# EasyEDA Pro project ProPrj_SCH_MOUSE_2024-12-04_2025-01-11.epro

# Schematic MOUSE
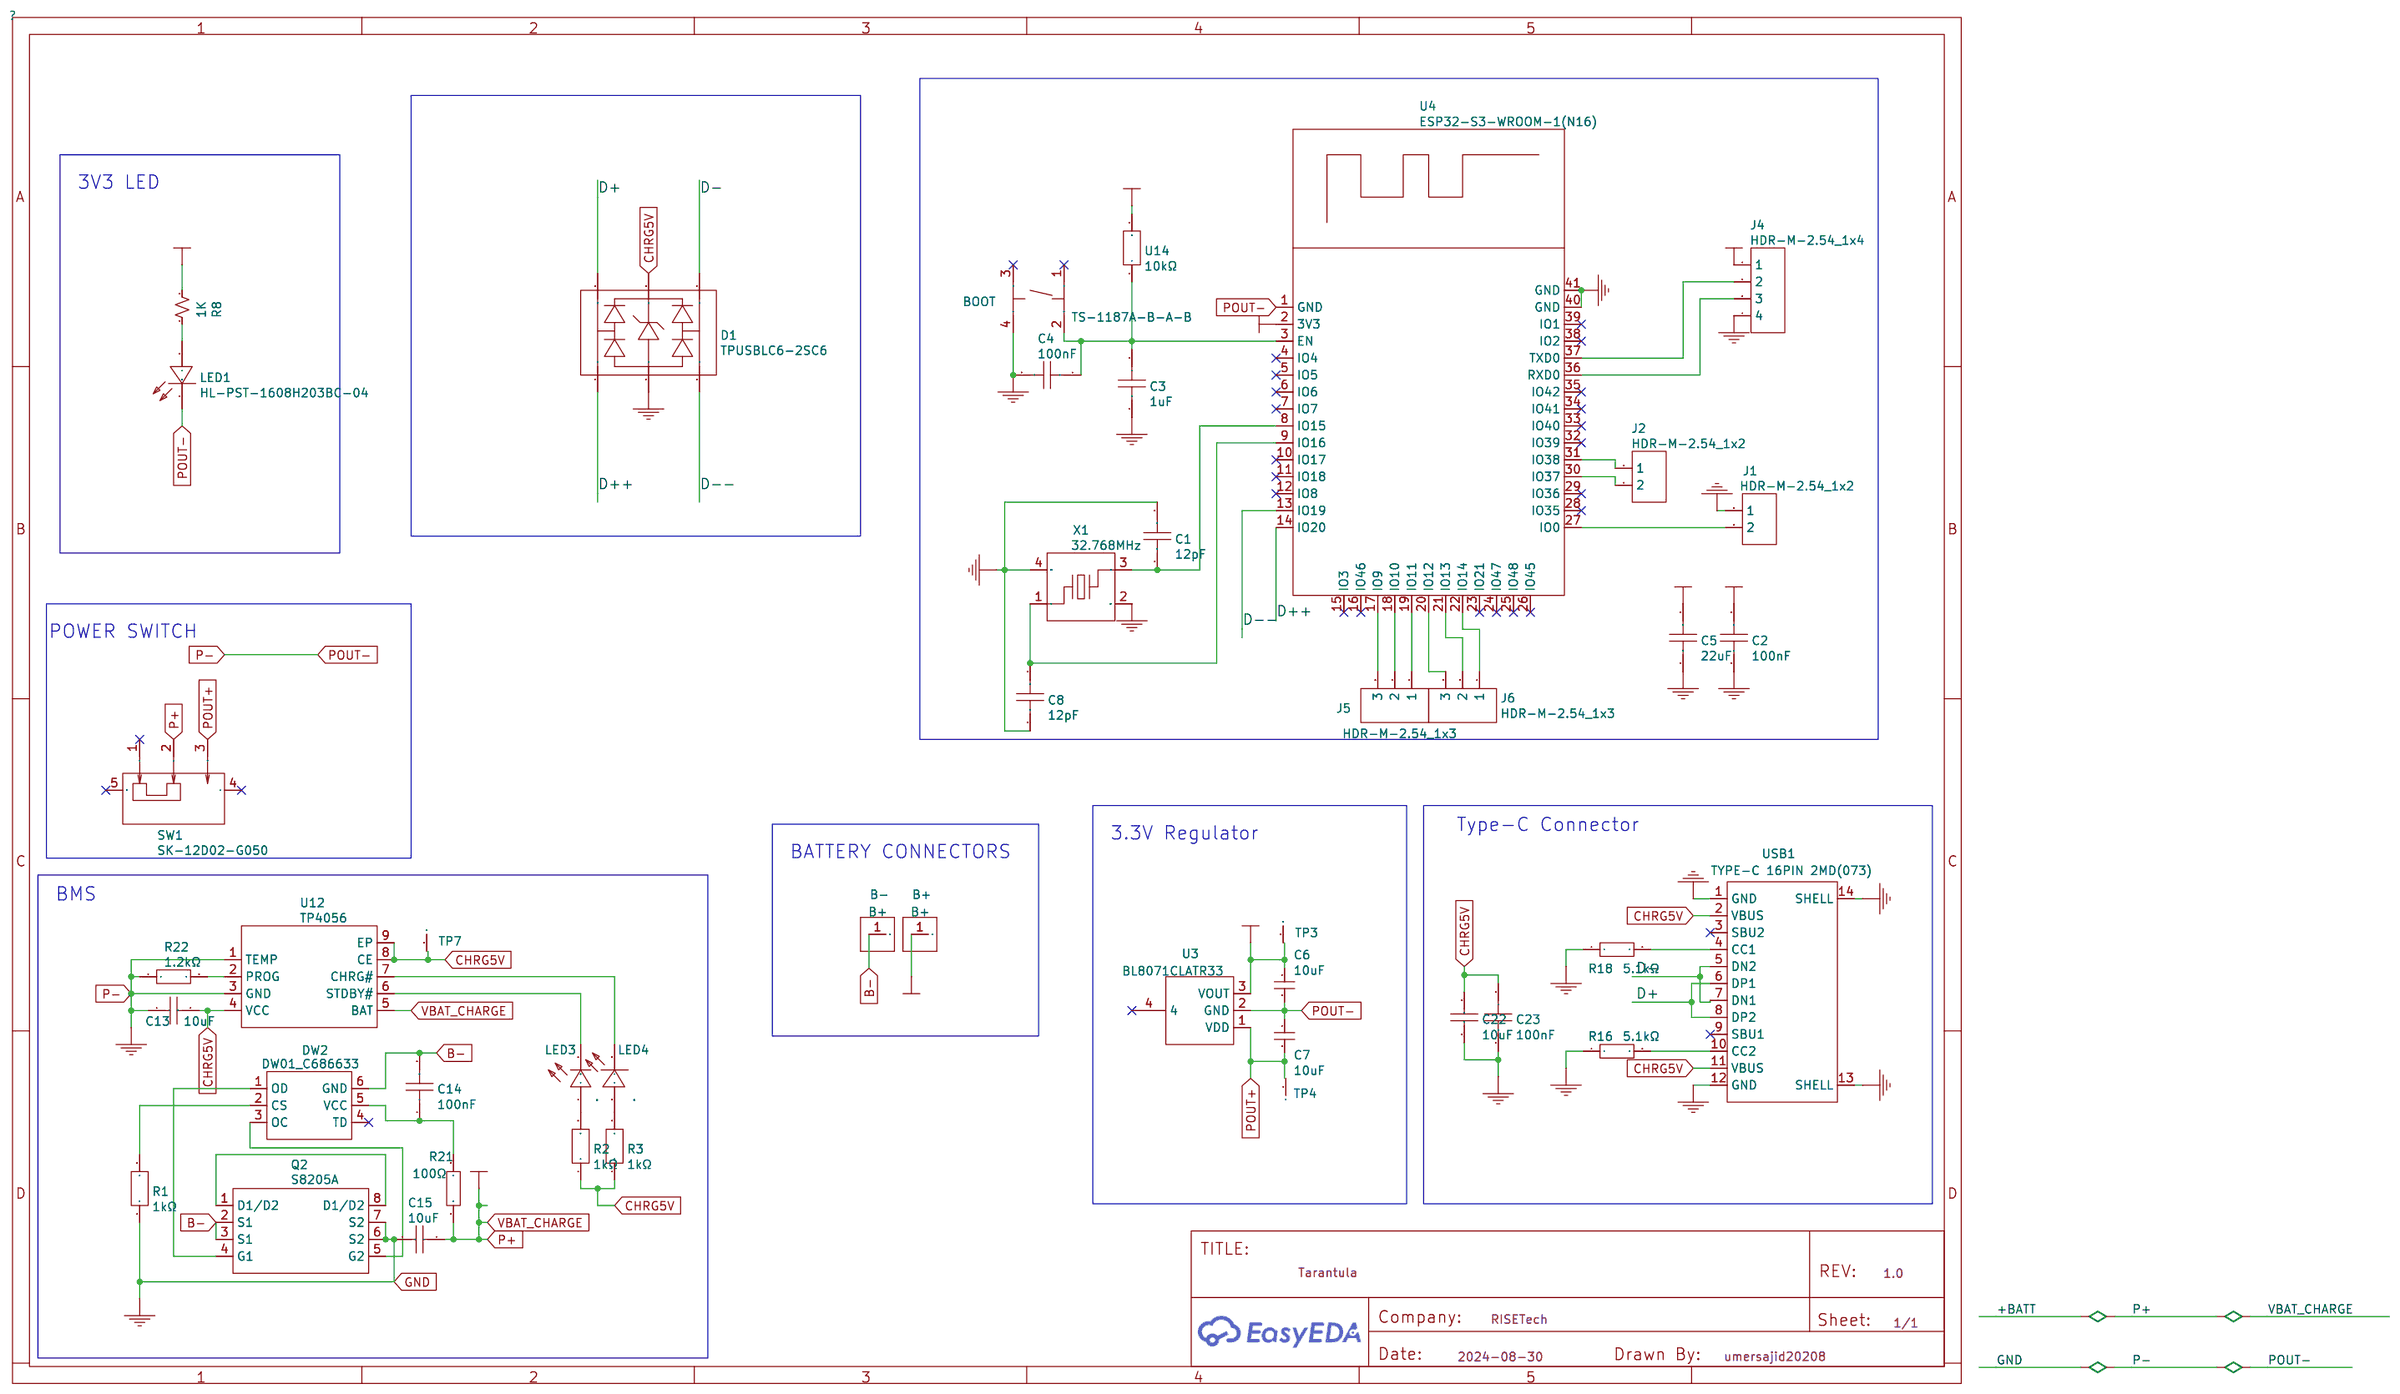
[diagram p0: schematic sheet]

## Parts
B+  B+  [TESTPOINT-SMD_L2.1-L1.1]
B-  B+  [TESTPOINT-SMD_L2.1-L1.1]
BOOT  TS-1187A-B-A-B  [SW-SMD_4P-L5.1-W5.1-P3.70-LS6.5-TL-2]
C1  12pF  [C0603]
C2  100nF  [C0402]
C3  1uF  [C0603]
C4  100nF  [C0402]
C5  22uF  [C0603]
C6  10uF  [C0603]
C7  10uF  [C0603]
C8  12pF  [C0603]
C13  10uF  [C0402]
C14  100nF  [C0402]
C15  10uF  [C0402]
C22  10uF  [C0402]
C23  100nF  [C0402]
D1  TPUSBLC6-2SC6  [SOT-23-6_L2.9-W1.6-P0.95-LS2.8-BR]
DW2  DW01_C686633  [SOT-23-6_L2.9-W1.6-P0.95-LS2.8-BR]
J1  HDR-M-2.54_1x2  [HDR-M-2.54_1X2]
J2  HDR-M-2.54_1x2  [HDR-M-2.54_1X2]
J4  HDR-M-2.54_1x4  [HDR-M-2.54_1X4]
J5  HDR-M-2.54_1x3  [HDR-M-2.54_1X3]
J6  HDR-M-2.54_1x3  [HDR-M-2.54_1X3]
LED1  HL-PST-1608H203BC-04  [LED0603-RD_BLUE]
LED3  .  [LED0603-R-RD]
LED4  .  [LED0603-R-RD]
Q2  S8205A  [TSSOP-8_L4.4-W3.0-P0.65-LS6.4-BL]
R1  1kΩ  [R0603]
R2  1kΩ  [R0603]
R3  1kΩ  [R0603]
R8  1K  [R0603]
R16  5.1kΩ  [R0402]
R18  5.1kΩ  [R0402]
R21  100Ω  [R0402]
R22  1.2kΩ  [R0402]
SW1  SK-12D02-G050  [SW-TH_SK-12D02-G050]
TP3  TEST_POINT_TH  [MEASUREMENT_POINT_TH]
TP4  TEST_POINT_TH  [MEASUREMENT_POINT_TH]
TP7  TEST_POINT_TH  [MEASUREMENT_POINT_TH]
U3  BL8071CLATR33  [SOT-223-3_L6.5-W3.4-P2.30-LS7.0-BR]
U4  ESP32-S3-WROOM-1(N16)  [WIRELM-SMD_ESP32-S3-WROOM-1]
U12  TP4056  [ESOP-8_L4.9-W3.9-P1.27-LS6.0-BL-EP]
U14  10kΩ  [R0402]
USB1  TYPE-C 16PIN 2MD(073)  [USB-C-SMD_TYPE-C-6PIN-2MD-073]
X1  32.768MHz  [CRYSTAL-SMD_4P-L3.2-W2.5-BL]

## Library data of the parts
B+ B- = B+
BOOT = TS-1187A-B-A-B: Supplier: LCSC; Supplier Part: C318884; Manufacturer: XKB Connectivity(中国星坤); JLCPCB Part Class: Basic Part
C1 C8 = 12pF: Supplier: LCSC; Supplier Part: C482468; Manufacturer: Chinocera(华瓷); Manufacturer Part: HGC0603G0120J500NTHJ; JLCPCB Part Class: Extended Part
C2 C4 = 100nF: Supplier: LCSC; Supplier Part: C432917; Manufacturer: TDK; Manufacturer Part: C1005X7R1H104KT000S; JLCPCB Part Class: Extended Part
C3 = 1uF: Supplier: LCSC; Supplier Part: C2918486; Manufacturer: SAMWHA(三和); Manufacturer Part: CS1608X5R105K250NRB; JLCPCB Part Class: Extended Part
C5 = 22uF: Supplier: LCSC; Supplier Part: C7432770; Manufacturer: Chinocera(华瓷); Manufacturer Part: HGC0603R5226M100NTHJ; JLCPCB Part Class: Extended Part
C6 C7 = 10uF: Manufacturer_Name: Samsung Electro-Mechanics; Manufacturer_Part_Number: CL21A106KOQNNNE; Manufacturer: Samsung Electro-Mechanics; Supplier Part: C19702
C13 C15 C22 = 10uF: Supplier: LCSC; Manufacturer Part: CL05A106MQ5NUNC; Manufacturer: SAMSUNG; Supplier Part: C15525; JLCPCB Part Class: Basic Part; Resistance: 5.1K
C14 C23 = 100nF: Supplier: LCSC; Supplier Part: C307331; Manufacturer: Samsung Electro-Mechanics; Manufacturer Part: CL05B104KB54PNC; JLCPCB Part Class: Basic Part
D1 = TPUSBLC6-2SC6: Supplier: LCSC; Supplier Part: C558442; Manufacturer: TECH PUBLIC(台舟); JLCPCB Part Class: Extended Part
DW2 = DW01_C686633: Supplier: LCSC; Supplier Part: C686633; Manufacturer: PJ(Pingjingsemi); Manufacturer Part: DW01; JLCPCB Part Class: Extended Part
J1 J2 = HDR-M-2.54_1x2: Supplier Part: C124375; Supplier: LCSC
J4 = HDR-M-2.54_1x4: Supplier Part: C124378; Supplier: LCSC
J5 J6 = HDR-M-2.54_1x3: Supplier Part: C180248; Supplier: LCSC
LED1 = HL-PST-1608H203BC-04: Supplier: LCSC; Supplier Part: C497939; Manufacturer: HONGLITRONIC(鸿利光电); JLCPCB Part Class: Extended Part
LED3 = .: Supplier: LCSC; Manufacturer: EVERLIGHT; Manufacturer Part: 19-217/GHC-YR1S2/3T; Supplier Part: C72043; JLCPCB Part Class: Basic Part
LED4 = .: Supplier: LCSC; Manufacturer: KENTO; Manufacturer Part: KT-0603R; Supplier Part: C2286; JLCPCB Part Class: Basic Part
Q2 = S8205A: Supplier: LCSC; Supplier Part: C436910; Manufacturer: TF(拓锋); JLCPCB Part Class: Extended Part
R1-R3 = 1kΩ: Supplier: LCSC; Supplier Part: C2924142; Manufacturer: Viking(光颉); Manufacturer Part: AR03FTDX1001A; JLCPCB Part Class: Extended Part
R8 = 1K: Manufacturer_Part_Number: AC0603JR-071KL; Supplier Part: C21190
R16 R18 = 5.1kΩ: Supplier: LCSC; Manufacturer: UniOhm; Manufacturer Part: 0402WGF5101TCE; Supplier Part: C25905; Resistance: 5.1K; JLCPCB Part Class: Basic Part
R21 = 100Ω: Supplier: LCSC; Manufacturer: UniOhm; Manufacturer Part: 0402WGF1000TCE; Supplier Part: C25076; Resistance: 100; JLCPCB Part Class: Basic Part
R22 = 1.2kΩ: Supplier: LCSC; Manufacturer: UniOhm; Manufacturer Part: 0402WGF1201TCE; Supplier Part: C25862; Resistance: 1.2K; JLCPCB Part Class: Basic Part
SW1 = SK-12D02-G050: Supplier: LCSC; Supplier Part: C2930975; Manufacturer: G-Switch(品赞); JLCPCB Part Class: Extended Part
TP3 TP4 TP7 = TEST_POINT_TH: Pin: 1
U3 = BL8071CLATR33: Supplier: LCSC; Supplier Part: C401677; Manufacturer: Shanghai Belling; JLCPCB Part Class: Extended Part
U4 = ESP32-S3-WROOM-1(N16): Supplier: LCSC; Supplier Part: C2913199; Manufacturer: ESPRESSIF(乐鑫); Manufacturer Part: ESP32-S3-WROOM-1-N16; JLCPCB Part Class: Extended Part
U12 = TP4056: Supplier: LCSC; Supplier Part: C16581; Manufacturer: TOPPOWER; JLCPCB Part Class: Basic Part
U14 = 10kΩ: Supplier: LCSC; Supplier Part: C5119777; Manufacturer: RALEC(旺诠); Manufacturer Part: RAT021002FTH; JLCPCB Part Class: Extended Part
USB1 = TYPE-C 16PIN 2MD(073): Supplier: LCSC; Supplier Part: C2765186; Manufacturer: SHOU HAN(首韩); JLCPCB Part Class: Extended Part
X1 = 32.768MHz: Supplier: LCSC; Supplier Part: C20885045; Manufacturer: YJX(雅晶鑫); Manufacturer Part: T322532768MLBDE2X; JLCPCB Part Class: Extended Part

## Nets
+3V3: C2.2 C5.2 C6.1 J4.1 R8.1 U3.3(VOUT) U4.2(3V3) U14.2
GND: BOOT.4(D) C1.2 C2.1 C3.1 C4.2 C5.1 C6.2 C7.1 C8.1 C13.1 C15.2 C22.1 C23.1 D1.2(GND) J1.1 J4.4 LED1.1(C) Q2.6(S2) Q2.7(S2) R1.1 R16.1 R18.1 R22.1 U3.2(GND) U4.1(GND) U4.40(GND) U4.41(GND) U12.1(TEMP) U12.3(GND) USB1.1(GND) USB1.12(GND) USB1.13(SHELL) USB1.14(SHELL) X1.2(GND) X1.4(GND)
+BATT: B+.1 C15.1 R21.1 SW1.2 U12.5(BAT)
B-: B-.1 C14.2 DW2.6(GND) Q2.2(S1) Q2.3(S1)
CHRG5V: C13.2 C22.2 C23.2 D1.5(VBUS) R2.1 R3.1 U12.4(VCC) U12.8(CE) U12.9(EP) USB1.2(VBUS) USB1.11(VBUS)
D+: D1.6(I/O1) USB1.6(DP1) USB1.8(DP2)
D++: D1.1(I/O1) U4.14(IO20)
D-: D1.4(I/O2) USB1.5(DN2) USB1.7(DN1)
D--: D1.3(I/O2) U4.13(IO19)
POUT+: C7.2 SW1.3 U3.1(VDD)
DW2_2: DW2.2(CS) R1.2
DW2_5: C14.1 DW2.5(VCC) R21.2
LED3_1: LED3.1(A) R2.2
LED3_2: LED3.2(C) U12.6(STDBY#)
LED4_1: LED4.1(A) R3.2
LED4_2: LED4.2(K) U12.7(CHRG#)
Q2_1: Q2.1(D1/D2) Q2.8(D1/D2)
Q2_4: DW2.1(OD) Q2.4(G1)
Q2_5: DW2.3(OC) Q2.5(G2)
R8_2: LED1.2(A) R8.2
R16_2: R16.2 USB1.10(CC2)
U4_3: BOOT.2(B) C3.2 C4.1 U4.3(EN) U14.1
U4_8: C1.1 U4.8(IO15) X1.3
U4_9: C8.2 U4.9(IO16) X1.1
U4_17: J5.3 U4.17(IO9)
U4_18: J5.2 U4.18(IO10)
U4_19: J5.1 U4.19(IO11)
U4_20: J6.3 U4.20(IO12)
U4_21: J6.2 U4.21(IO13)
U4_22: J6.1 U4.22(IO14)
U4_27: J1.2 U4.27(IO0)
U4_30: J2.2 U4.30(IO37)
U4_31: J2.1 U4.31(IO38)
U4_36: J4.3 U4.36(RXD0)
U4_37: J4.2 U4.37(TXD0)
U12_2: R22.2 U12.2(PROG)
USB1_4: R18.2 USB1.4(CC1)

Not connected (* = marked no-connect by the designer): BOOT 1(A)* 3(C)*; DW2 4(TD)*; SW1 1* 4* 5*; TP3 1; TP4 1; TP7 1; U3 4*; U4 4(IO4)* 5(IO5)* 6(IO6)* 7(IO7)* 10(IO17)* 11(IO18)* 12(IO8)* 15(IO3)* 16(IO46)* 23(IO21)* 24(IO47)* 25(IO48)* 26(IO45)* 28(IO35)* 29(IO36)* 32(IO39)* 33(IO40)* 34(IO41)* 35(IO42)* 38(IO2)* 39(IO1)*; USB1 3(SBU2)* 9(SBU1)*

## Notes on the sheet
- 3V3 LED
- POWER SWITCH
- 3.3V Regulator
- Type-C Connector
- BATTERY CONNECTORS
- BMS

# Board PCB_PCB_MOUSE_2024-12-04
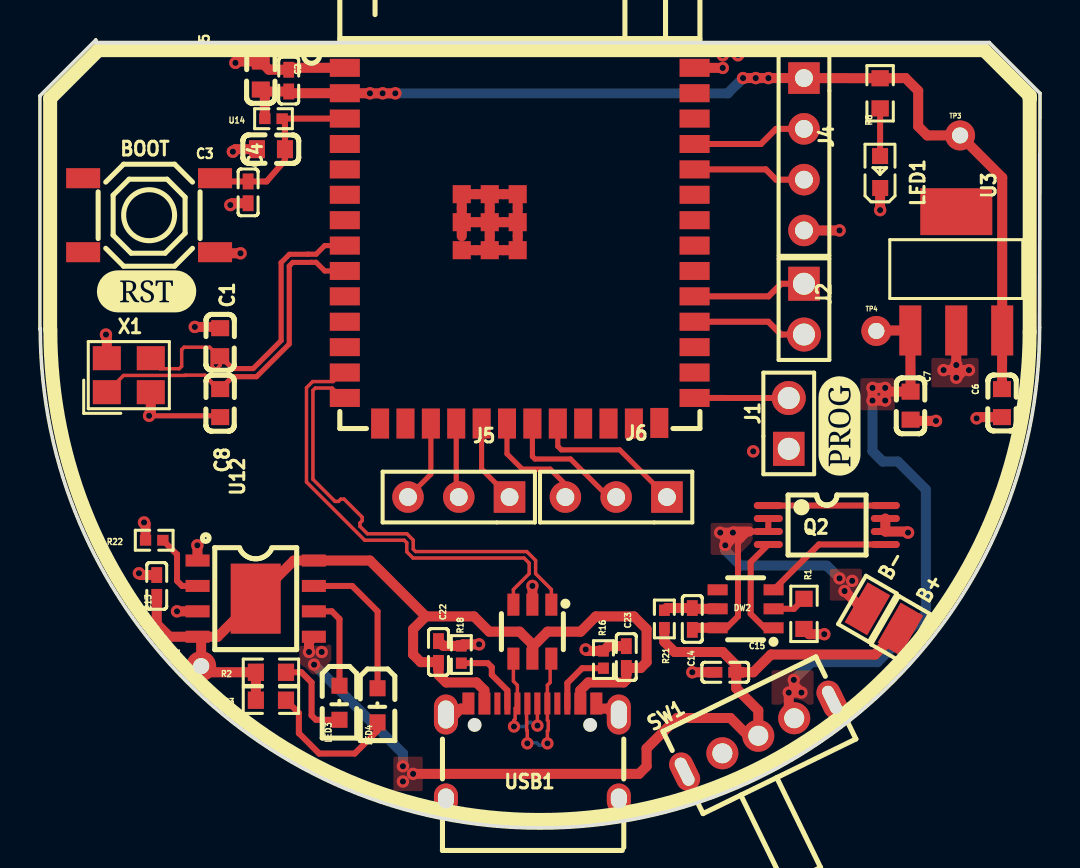
[diagram p1: board, top side]
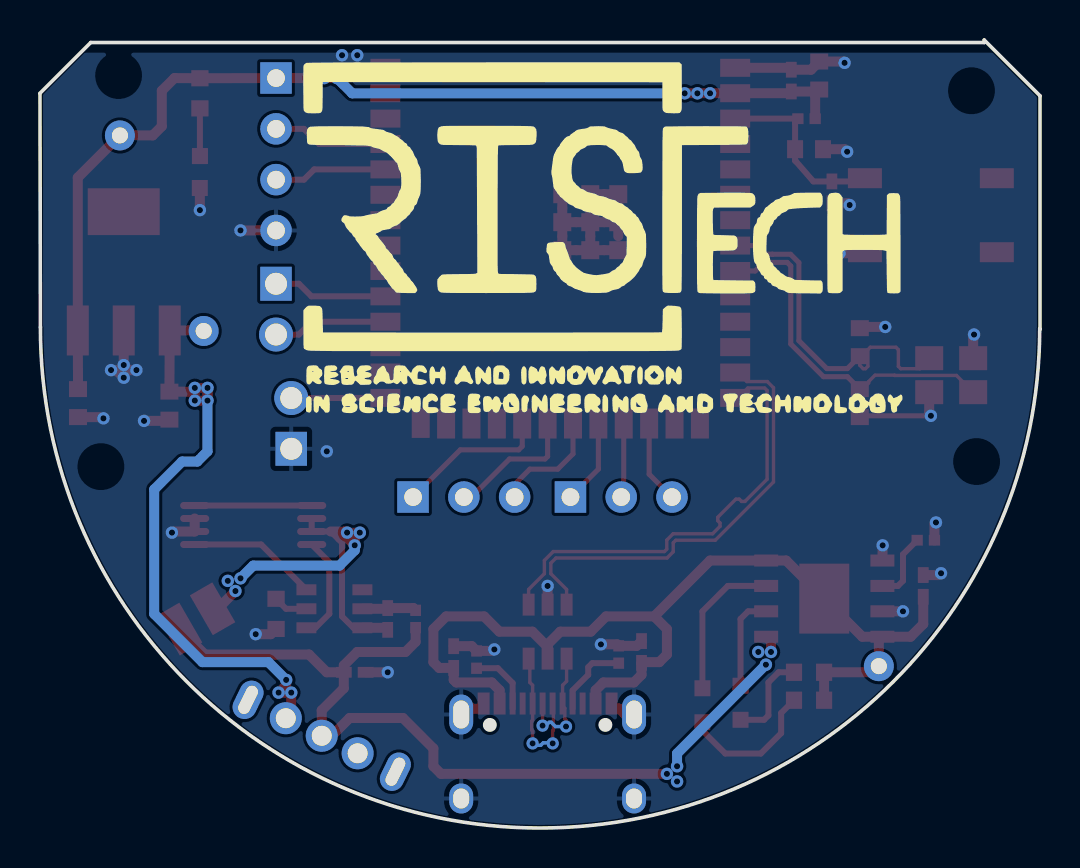
[diagram p2: board, bottom side, seen from below]

Outline 50.04 x 39.41 mm; copper layers: Top Layer, Bottom Layer. Coordinates in mm from the lower left corner of the outline.
Outline path: 0,24.96 0,36.62 2.79,39.41 2.79,39.28 47.5,39.28 50.04,36.74 50.02,25.03 arc(25.05,0) 0.02,24.97 0,24.93
Stack: Top Layer 0.035mm / Dielectric1 1.51mm FR4 er 4.5 / Bottom Layer 0.035mm

## Design rules (mm)
net U4_8: DP3
net U4_9: DP3
net D--: DP1
net D++: DP1
net D-: DP2
net D+: DP2
spacing Default (default): track to track 0.152, other pairs 0 to 0.152
track width Default (default): min 0.254, default 0.254, max 25.4
differential pair differentialPair (default): width min 0.127, default 0.254, max 2.54; gap min 0.152, default 0.152
via Default (default): diameter min 0.61, default 0.61, max 100.025; hole min 0.305, default 0.305, max 59.995
pour e310 uses gge60067
pour e312 uses gge60073
pour e314 uses gge60079
pour e316 uses gge60091
pour e318 uses gge60235
pour e320 uses gge60241
pour e322 uses gge61048

## Placement (name value [footprint] x y rotation side)
B+  B+  [TESTPOINT-SMD_L2.1-L1.1]  43.05 9.95 60 top
B-  B+  [TESTPOINT-SMD_L2.1-L1.1]  41.4 10.96 60 top
BOOT  TS-1187A-B-A-B  [SW-SMD_4P-L5.1-W5.1-P3.70-LS6.5-TL-2]  5.46 30.65 0 top
C1  12pF  [C0603]  9.02 24.3 90 top
C2  100nF  [C0402]  12.45 37.38 270 top
C3  1uF  [C0603]  11.56 33.95 0 top
C4  100nF  [C0402]  10.41 31.79 270 top
C5  22uF  [C0603]  11.05 37.63 270 top
C6  10uF  [C0603]  48.13 21.25 270 top
C7  10uF  [C0603]  43.56 21.12 90 top
C8  12pF  [C0603]  9.02 21.25 90 top
C13  10uF  [C0402]  5.84 12.11 270 top
C14  100nF  [C0402]  32.64 10.46 270 top
C15  10uF  [C0402]  34.29 7.79 180 top
C22  10uF  [C0402]  19.94 8.8 270 top
C23  100nF  [C0402]  29.34 8.55 270 top
D1  TPUSBLC6-2SC6  [SOT-23-6_L2.9-W1.6-P0.95-LS2.8-BR#2]  24.64 9.82 90 top
DW2  DW01_C686633  [SOT-23-6_L2.9-W1.6-P0.95-LS2.8-BR]  35.31 10.96 0 top
J1  HDR-M-2.54_1x2  [HDR-M-2.54_1X2]  37.47 20.23 90 top
J2  HDR-M-2.54_1x2  [HDR-M-2.54_1X2]  38.23 25.95 270 top
J4  HDR-M-2.54_1x4  [HDR-M-2.54_1X4]  38.23 33.7 270 top
J5  HDR-M-2.54_1x3  [HDR-M-2.54_1X3]  20.95 16.55 180 top
J6  HDR-M-2.54_1x3  [HDR-M-2.54_1X3]  28.83 16.55 180 top
LED1  HL-PST-1608H203BC-04  [LED0603-RD_BLUE]  42.04 32.81 90 top
LED3  .  [LED0603-R-RD]  14.99 6.26 270 top
LED4  .  [LED0603-R-RD]  16.89 6.14 270 top
Q2  S8205A  [TSSOP-8_L4.4-W3.0-P0.65-LS6.4-BL]  39.37 15.15 270 top
R1  1kΩ  [R0603]  38.23 10.71 90 top
R2  1kΩ  [R0603]  11.56 7.79 0 top
R3  1kΩ  [R0603]  11.56 6.39 0 top
R8  1K  [R0603]  42.04 36.74 270 top
R16  5.1kΩ  [R0402]  28.19 8.42 270 top
R18  5.1kΩ  [R0402]  21.08 8.68 270 top
R21  100Ω  [R0402]  31.24 10.46 90 top
R22  1.2kΩ  [R0402]  5.72 14.39 0 top
SW1  SK-12D02-G050  [SW-TH_SK-12D02-G050]  35.94 4.61 26 top
TP3  TEST_POINT_TH  [MEASUREMENT_POINT_TH]  -78.23 173.78 0 top
TP4  TEST_POINT_TH  [MEASUREMENT_POINT_TH]  -82.42 164 0 top
TP7  TEST_POINT_TH  [MEASUREMENT_POINT_TH]  -116.2 147.23 0 top
U3  BL8071CLATR33  [SOT-223-3_L6.5-W3.4-P2.30-LS7.0-BR]  45.85 27.85 270 top
U4  ESP32-S3-WROOM-1(N16)  [WIRELM-SMD_ESP32-S3-WROOM-1]  24 29.12 0 top
U12  TP4056  [ESOP-8_L4.9-W3.9-P1.27-LS6.0-BL-EP]  10.79 11.47 270 top
U14  10kΩ  [R0402]  11.68 35.47 180 top
USB1  TYPE-C 16PIN 2MD(073)  [USB-C-SMD_TYPE-C-6PIN-2MD-073]  24.64 3.85 0 top
X1  32.768MHz  [CRYSTAL-SMD_4P-L3.2-W2.5-BL]  4.44 22.65 0 top

## Footprints (pads in the part's own frame, mm; a bottom-side part is the same pattern mirrored in y, then rotated)
C0402
  rect 0.79x0.54 smd: 1(-0.545,0) 2(0.545,0)
C0603
  rect 0.8x0.9 smd: 1(-0.7,0) 2(0.7,0)
CRYSTAL-SMD_4P-L3.2-W2.5-BL
  rect 1.4x1.2 smd: 1(-1.1,-0.85) 2(1.1,-0.85) 3(1.1,0.85) 4(-1.1,0.85)
ESOP-8_L4.9-W3.9-P1.27-LS6.0-BL-EP
  rect 0.6x1.2 smd: 1(-1.905,-2.909) 2(-0.635,-2.909) 3(0.635,-2.909) 4(1.905,-2.909) 5(1.905,2.909) 6(0.635,2.909) 7(-0.635,2.909) 8(-1.905,2.909)
  rect 3.5x2.5 smd: 9(0,0)
HDR-M-2.54_1X2
  rect 1.7x1.575 hole 1.1: 1(-1.27,0)
  round 1.7 hole 1.1: 2(1.27,0)
HDR-M-2.54_1X3
  rect 1.575x1.575 hole 0.889: 1(-2.54,0)
  round 1.575 hole 0.889: 2(0,0) 3(2.54,0)
HDR-M-2.54_1X4
  rect 1.575x1.575 hole 0.889: 1(-3.81,0)
  round 1.575 hole 0.889: 2(-1.27,0) 3(1.27,0) 4(3.81,0)
LED0603-R-RD
  rect 0.8x0.8 smd: 1(0.851,0) 2(-0.851,0)
LED0603-RD_BLUE
  rect 0.8x0.8 smd: 1(-0.799,-0.004) 2(0.799,0.004)
MEASUREMENT_POINT_TH
  round 1.5 hole 0.805x0.8: 1(124.27,-139.139)
R0402
  rect 0.566x0.54 smd: 1(-0.433,0) 2(0.433,0)
R0603
  rect 0.806x0.864 smd: 1(-0.753,0) 2(0.753,0)
SOT-23-6_L2.9-W1.6-P0.95-LS2.8-BR
  rect 1x0.55 smd: 1(1.4,-0.95) 2(1.4,0) 3(1.4,0.95) 4(-1.4,0.95) 5(-1.4,0) 6(-1.4,-0.95)
SOT-23-6_L2.9-W1.6-P0.95-LS2.8-BR#2
  rect 1.1x0.6 smd: 1(1.35,-0.95) 2(1.35,0) 3(1.35,0.95) 4(-1.35,0.95) 5(-1.35,0) 6(-1.35,-0.95)
SOT-223-3_L6.5-W3.4-P2.30-LS7.0-BR
  rect 2.5x1.1 smd: 1(2.97,-2.3) 2(2.97,0) 3(2.97,2.3)
  rect 2.34x3.6 smd: 4(-2.97,0)
SW-SMD_4P-L5.1-W5.1-P3.70-LS6.5-TL-2
  rect 1.7x1 smd: 1(-3.3,1.85) 2(3.3,1.85) 3(-3.3,-1.85) 4(3.3,-1.85)
SW-TH_SK-12D02-G050
  round 1.6 hole 1: 1(-2,0) 2(0,0) 3(2,0)
  oval 1.2x2 hole 0.6x1.5: 4(-4.1,0) 5(4.1,0)
TESTPOINT-SMD_L2.1-L1.1
  rect 2.3x1.3 smd: 1(0,0)
TSSOP-8_L4.4-W3.0-P0.65-LS6.4-BL
  oval 0.353x1.454 smd: 1(-0.975,-2.927) 2(-0.325,-2.927) 3(0.325,-2.927) 4(0.975,-2.927) 5(0.975,2.927) 6(0.325,2.927) 7(-0.325,2.927) 8(-0.975,2.927)
USB-C-SMD_TYPE-C-6PIN-2MD-073
  rect 0.6x1.1 smd: 1(-3.2,2.375) 2(-2.4,2.375) 11(2.401,2.375) 12(3.2,2.375)
  rect 0.3x1.1 smd: 3(-1.75,2.375) 4(-1.25,2.375) 5(-0.75,2.375) 6(-0.25,2.375) 7(0.25,2.375) 8(0.75,2.375) 9(1.25,2.375) 10(1.75,2.375)
  oval 1.2x2 hole 0.8x1.4: 13(-4.325,1.825) 14(4.325,1.825)
  oval 1.2x1.5 hole 0.8x1: 13(-4.325,-2.375) 14(4.325,-2.375)
WIRELM-SMD_ESP32-S3-WROOM-1
  rect 1.5x0.9 smd: 1(-8.75,8.895) 2(-8.75,7.625) 3(-8.75,6.355) 4(-8.75,5.085) 5(-8.75,3.815) 6(-8.75,2.545) 7(-8.75,1.275) 8(-8.75,0.005) 9(-8.75,-1.265) 10(-8.75,-2.535) 11(-8.75,-3.805) 12(-8.75,-5.075) 13(-8.75,-6.345) 14(-8.75,-7.615) 27(8.75,-7.615) 28(8.75,-6.345) 29(8.75,-5.075) 30(8.75,-3.805) 31(8.75,-2.535) 32(8.75,-1.265) 33(8.75,0.005) 34(8.75,1.275) 35(8.75,2.545) 36(8.75,3.815) 37(8.75,5.085) 38(8.75,6.355) 39(8.75,7.625) 40(8.75,8.895)
  rect 0.9x1.5 smd: 15(-6.985,-8.895) 16(-5.715,-8.895) 17(-4.445,-8.895) 18(-3.175,-8.895) 19(-1.905,-8.895) 20(-0.635,-8.895) 21(0.635,-8.895) 22(1.905,-8.895) 23(3.175,-8.895) 24(4.445,-8.895) 25(5.715,-8.895) 26(6.985,-8.865)
  rect 0.9x0.9 smd: 41(-2.9,2.575) 41(-2.9,1.175) 41(-2.9,-0.225) 41(-1.5,2.575) 41(-1.5,1.175) 41(-1.5,-0.226) 41(-0.1,2.575) 41(-0.1,1.175) 41(-0.1,-0.225)

## Nets
As in the schematic, except:
+3V3: C2.2 C5.2 C6.1 J4.1 R8.1 TP3.1 U3.3 U4.2 U14.2
CHRG5V: C13.2 C22.2 C23.2 D1.5 R2.1 R3.1 TP7.1 U12.4 U12.8 U12.9 USB1.2 USB1.11
P+: B+.1 C15.1 R21.1 SW1.2 U12.5
POUT+: C7.2 SW1.3 TP4.1 U3.1

Pads without a net: BOOT 1 3; DW2 4; SW1 1 4 5; U3 4; U4 4 5 6 7 10 11 12 15 16 23 24 25 26 28 29 32 33 34 35 38 39; USB1 3 9

## Via types
v1: diameter 0.62, hole 0.31, Top Layer to Bottom Layer, 54 vias
v2: diameter 0.61, hole 0.305, Top Layer to Bottom Layer, 4 vias

## Routing (per net, layer and track width the routed paths; a pad name or vN(x,y) marks a point on that pad's centre or on a via; arc(x,y) is an arc through that point)
+3V3: length 52.7
  Top Layer w0.5: U14.2 11.25,36.73 C5.2 11.15,36.83 C2.2 12.53,36.75 U4.2 v1(16.51,36.74) v1(17.15,36.74) v1(17.78,36.74) ; U3.3 48.15,32.53 TP3.1 ; v1(35.18,37.51) v1(35.81,37.51) v1(36.45,37.51) J4.1 42.04,37.5 43.31,37.51 43.94,36.87 43.94,35.09 44.4,34.64 46.04,34.64 ; 48.15,24.89 48.13,21.95
  Bottom Layer w0.5: v1(35.18,37.51) 34.42,36.74 v1(17.78,36.74)
GND: length 58.4
  Top Layer w0.254: C8.1 8.95,20.62 v1(5.46,20.62)
  Top Layer w0.5: v1(6.86,10.84) U12.3 ; 21.1,28.9 21.8,28.9 ; v1(5.21,15.28) 5.28,15.21 R22.1 ; C22.1 20.18,9.11 21.08,9.11 21.16,9.19 v1(21.97,9.19) ; v1(43.43,14.77) 43.38,14.83 Q2.6 Q2.7 ; U4.41 U4.41 ; U4.41 U4.41 ; U4.41 U4.41 ; U4.41 U4.41 ; 27.84,5.97 28.41,5.97 28.96,5.42 ; v1(24.64,12.11) D1.2 ; U4.41 U4.41 U4.41 ; U4.41 U4.41 U4.41 ; C13.1 5.04,12.65 v1(4.95,12.74) ; J4.4 v1(40,29.89) ; BOOT.4 8.82,28.74 v1(10.03,28.74) ; v1(44.83,20.36) 43.62,20.36 C7.1 ; v1(3.3,24.68) 3.3,24.56 3.34,24.51 X1.4 ; v1(27.31,8.93) 27.38,8.86 R16.1 28.43,9.1 C23.1 ; U4.40 v1(34.16,38.01) ; U4.41 U4.41 ; U4.41 21.8,28.9 ; U4.41 23.2,28.9 ; U4.41 21.1,29.6 ; C3.1 9.78,33.95 v1(9.65,33.82) ; R1.1 38.49,9.69 v1(39.24,9.69) ; v1(45.85,22.52) 46.23,22.9 v1(46.48,22.9) ; v1(45.21,22.9) 45.59,22.9 v1(45.85,23.16) U3.2 ; C6.2 46.93,20.55 v1(46.86,20.49) ; C4.2 9.62,31.25 v1(9.53,31.16) ; C1.2 8.95,25.06 v1(7.75,25.06) ; 20.31,5.42 20.57,5.68 20.76,5.68 21.06,5.97 21.44,5.97 ; X1.2 5.55,20.78 5.46,20.7 v1(5.46,20.62) ; C15.2 v1(32.64,7.79) ; v1(9.78,38.27) 9.84,38.33 C5.1 11.46,37.92 C2.1 12.54,38.02 U4.1 ; v1(7.87,14.14) U12.1 ; 42.04,32.01 v1(42.04,30.9) ; 23.9,28.9 23.2,28.9
  vias: v1(34.16,38.65) v1(34.93,38.65) v1(35.69,18.84)
B-: length 19.9
  Top Layer w0.3: Q2.2 Q2.3 35.49,14.83 34.93,14.27 34.93,10.58 34.36,10.01 DW2.6 ; 35.1,14.44 35.02,14.52 34.93,14.52
  Top Layer w0.5: v1(34.67,14.77) 34.67,14.52 v1(34.29,14.14) 34.29,14.52 v1(34.04,14.77) v1(34.67,14.77) ; v1(34.67,14.77) 34.73,14.83 35.49,14.83 ; B-.1 41.15,10.96 v1(40.26,11.85) ; DW2.6 32.74,10.01 C14.2
  Bottom Layer w0.5: v1(34.29,14.14) 34.29,13.88 35.05,13.12 39.37,13.12 v1(40,12.49)
  vias: v1(40.64,12.36)
CHRG5V: length 52
  Top Layer w0.5: R3.1 R2.1 8.37,7.79 TP7.1 8.06,9.39 U12.4 ; 19.3,10.58 21.72,10.58 22.48,9.82 24,9.82 24.64,9.19 24.64,8.47 24.64,9.06 25.4,9.82 27.05,9.82 27.81,10.58 29.72,10.58 30.35,9.95 30.35,8.3 30.06,8.01 C23.2 29.34,7.41 29.21,7.28 27.43,7.28 27.04,6.89 27.04,5.97 ; 19.3,10.58 16.51,13.38 U12.8 12.7,13.38 U12.9 8.89,9.57 U12.4 ; 19.3,10.58 18.67,9.95 18.67,8.68 19.05,8.3 19.9,8.3 C22.2 19.94,7.66 20.32,7.28 21.84,7.28 22.24,6.89 22.24,5.97 ; U12.4 6.48,9.57 5.84,10.2 C13.2
D+: length 7.4
  Top Layer w0.17: 24.39,6.1 24.35,6.06 24.35,4.9 24.38,4.86 v2(24.38,4.23) ; v2(25.39,4.23) 25.39,4.85 25.43,4.9 25.43,5.35 25.39,5.39 25.39,7.14 25.53,7.28 25.53,8.41 25.59,8.47
  Bottom Layer w0.17: v2(24.38,4.23) 24.41,4.26 24.86,4.26 24.98,4.14 25.3,4.14 v2(25.39,4.23)
D++: length 22.4
  Top Layer w0.17: D1.1 25.59,11.93 24.8,12.72 24.8,13.38 24.36,13.83 18.8,13.83 18.68,13.95 18.68,14.4 18.36,14.72 16.38,14.72 16.01,15.09 16.01,15.26 16.12,15.37 16.12,15.54 15.22,16.45 15.05,16.45 14.93,16.33 14.76,16.33 13.66,17.44 13.66,21.89 13.78,22.01 14.62,22.01 15.12,21.51 U4.14
D-: length 5.9
  Top Layer w0.17: v2(24.89,5.12) 24.89,5.13 24.89,6.1 ; 23.69,8.47 23.69,7.34 23.89,7.14 23.89,6.1 23.78,5.99 23.78,5.45 23.72,5.39 v2(23.72,5.07)
  Bottom Layer w0.17: v2(24.89,5.12) 24.72,5.12 24.55,5.29 24.46,5.29 24.24,5.07 v2(23.72,5.07)
D--: length 22.4
  Top Layer w0.17: U4.13 15.12,22.78 14.67,22.33 13.64,22.33 13.34,22.02 13.34,17.31 16.25,14.39 18.23,14.39 18.35,14.27 18.35,13.81 18.66,13.5 24.22,13.5 24.48,13.25 24.48,12.72 23.69,11.93 D1.3
DW2_2: length 1.7
  Top Layer w0.3: R1.2 37.73,10.96 36.71,10.96
DW2_5: length 2.7
  Top Layer w0.5: R21.2 31.35,11 C14.1 32.68,10.96 DW2.5
LED3_1: length 4.6
  Top Layer w0.3: LED3.1 13.81,5.41 13.59,5.63 13.59,7.28 13.08,7.79 R2.2
LED3_2: length 4.8
  Top Layer w0.3: U12.6 14.6,10.84 14.99,10.46 LED3.2
LED4_1: length 7.2
  Top Layer w0.3: R3.2 12.95,5.75 12.95,4.74 13.97,3.72 15.75,3.72 16.89,4.87 LED4.1
LED4_2: length 7.6
  Top Layer w0.3: 13.7,12.11 15.62,12.11 16.89,10.84 LED4.2
P+: length 45
  Top Layer w0.5: v1(18.67,2.71) 29.97,2.71 30.35,3.09 30.35,3.98 31.88,5.5 34.54,5.5 35.43,4.61 SW1.2 35.94,5.88 34.84,6.99 34.84,7.79 35.69,7.79 36.58,8.68 41.78,8.68 B+.1 ; R21.1 31.24,9.31 31.75,8.8 34.16,8.8 34.84,8.13 C15.1 ; v1(13.46,8.8) 13.46,9.33 U12.5
  Bottom Layer w0.5: v1(18.16,3.09) 18.16,3.72 v1(13.72,8.17)
  vias: v1(14.1,8.8) v1(18.16,2.33)
POUT+: length 31.7
  Top Layer w0.5: v1(42.29,22.01) v1(42.29,21.38) v1(41.66,21.38) v1(41.66,22.01) v1(42.29,22.01) ; v1(42.29,22.01) 42.48,21.82 C7.2 ; 43.55,24.89 43.56,21.82 ; U3.1 41.87,24.88 TP4.1 ; v1(37.72,7.41) 37.72,7.15 v1(38.1,6.77) v1(37.47,6.77) 37.47,5.76 SW1.3
  Bottom Layer w0.5: v1(37.72,7.41) 38.61,8.3 41.91,8.3 44.32,10.71 44.32,16.93 42.93,18.33 42.16,18.33 41.66,18.84 v1(41.66,21.38)
Q2_1: length 5.9
  Top Layer w0.3: Q2.1 Q2.8
Q2_4: length 5.3
  Top Layer w0.3: Q2.4 35.56,13.3 35.56,10.71 36.26,10.01 36.71,10.01
Q2_5: length 6.5
  Top Layer w0.3: Q2.5 38.97,14.18 36.71,11.91
R8_2: length 2.4
  Top Layer w0.3: 42.04,35.99 42.03,33.61
R16_2: length 3.4
  Top Layer w0.3: 26.39,5.97 26.39,7.25 27.13,7.99 28.19,7.99
U4_3: length 9.3
  Top Layer w0.3: U4.3 12.12,35.48 U14.1 12.26,35.33 C3.2 12.26,33.38 12.19,33.32 11.34,32.34 C4.1 8.92,32.34 BOOT.2
U4_8: length 17.5
  Top Layer w0.17: X1.3 5.55,23.43 6.01,22.97 6.97,22.97 7.09,23.09 7.09,23.92 7.21,24.04 8.49,24.04 8.61,23.92 8.61,23.09 8.73,22.97 8.85,22.97 9.02,23.14 C1.1
  Top Layer w0.254: C1.1 9.64,22.98 10.67,22.98 12.06,24.37 12.06,28.28 12.48,28.69 13.39,28.69 13.4,28.7 13.82,28.7 14.25,29.13 U4.8
U4_9: length 17.7
  Top Layer w0.17: X1.1 4.18,22.63 7.27,22.63 7.28,22.65 8.25,22.65 8.57,22.33 8.57,22.26 8.88,21.95 C8.2
  Top Layer w0.254: C8.2 9.64,22.57 10.84,22.57 12.47,24.21 12.47,28.11 12.65,28.29 13.56,28.29 13.56,28.29 13.82,28.29 14.25,27.86 U4.9
U4_17: length 4.2
  Top Layer w0.254: J5.3 19.56,17.69 U4.17
U4_18: length 3.7
  Top Layer w0.254: 20.83,20.23 20.83,16.68 J5.2
U4_19: length 4.3
  Top Layer w0.254: U4.19 22.1,17.95 J5.1
U4_20: length 5.7
  Top Layer w0.254: J6.3 26.29,17.19 25.53,17.95 24.13,17.95 23.37,18.71 U4.20
U4_21: length 6.7
  Top Layer w0.254: J6.2 28.45,16.55 26.54,18.46 24.76,18.46 24.64,18.58 U4.21
U4_22: length 7.7
  Top Layer w0.254: U4.22 25.91,19.09 26.09,18.91 29.01,18.91 J6.1
U4_27: length 4.7
  Top Layer w0.3: U4.27 37.47,21.5
U4_30: length 5.7
  Top Layer w0.3: U4.30 36.44,25.32 37.08,24.68 J2.2
U4_31: length 5.7
  Top Layer w0.3: U4.31 36.45,26.59 37.08,27.22 J2.1
U4_36: length 5.7
  Top Layer w0.3: J4.3 36.83,32.43 36.32,32.94 U4.36
U4_37: length 5.8
  Top Layer w0.3: J4.2 36.83,34.97 36.07,34.21 U4.37
U12_2: length 3.5
  Top Layer w0.3: R22.2 6.86,13.68 6.86,12.36 7.11,12.11 7.89,12.11
USB1_4: length 4
  Top Layer w0.3: 23.39,5.97 23.39,6.88 22.61,7.66 22.61,8.04 22.4,8.25 R18.2

## Copper pours and planes (outline as drawn; the poured copper is in the pictures)
GND on Top Layer: 44.7,23.41 46.86,23.41 46.86,22.14 44.7,22.14
GND on Bottom Layer: -9.65,38.78 53.72,38.78 53.72,-5.93 -9.65,-5.93
GND on Bottom Layer: -8.51,39.28 52.83,39.28 52.83,-4.66 -8.51,-4.66
B- on Top Layer: 33.66,15.15 35.56,15.15 35.56,14.39 34.93,13.76 33.66,13.76
B- on Top Layer: 39.62,12.87 41.02,12.87 41.02,12.23 40.26,11.47 39.62,11.47
P+ on Top Layer: 13.08,9.19 14.48,9.19 14.48,8.42 13.84,7.79 13.59,7.79 13.08,8.3
P+ on Top Layer: 17.78,3.47 19.05,3.47 19.05,1.95 17.78,1.95
POUT+ on Top Layer: 41.15,22.39 42.67,22.39 42.67,21 41.15,21
POUT+ on Top Layer: 36.7,7.79 38.61,7.79 38.61,6.26 36.7,6.26
